# Altium project LbElectric.PrjPCB
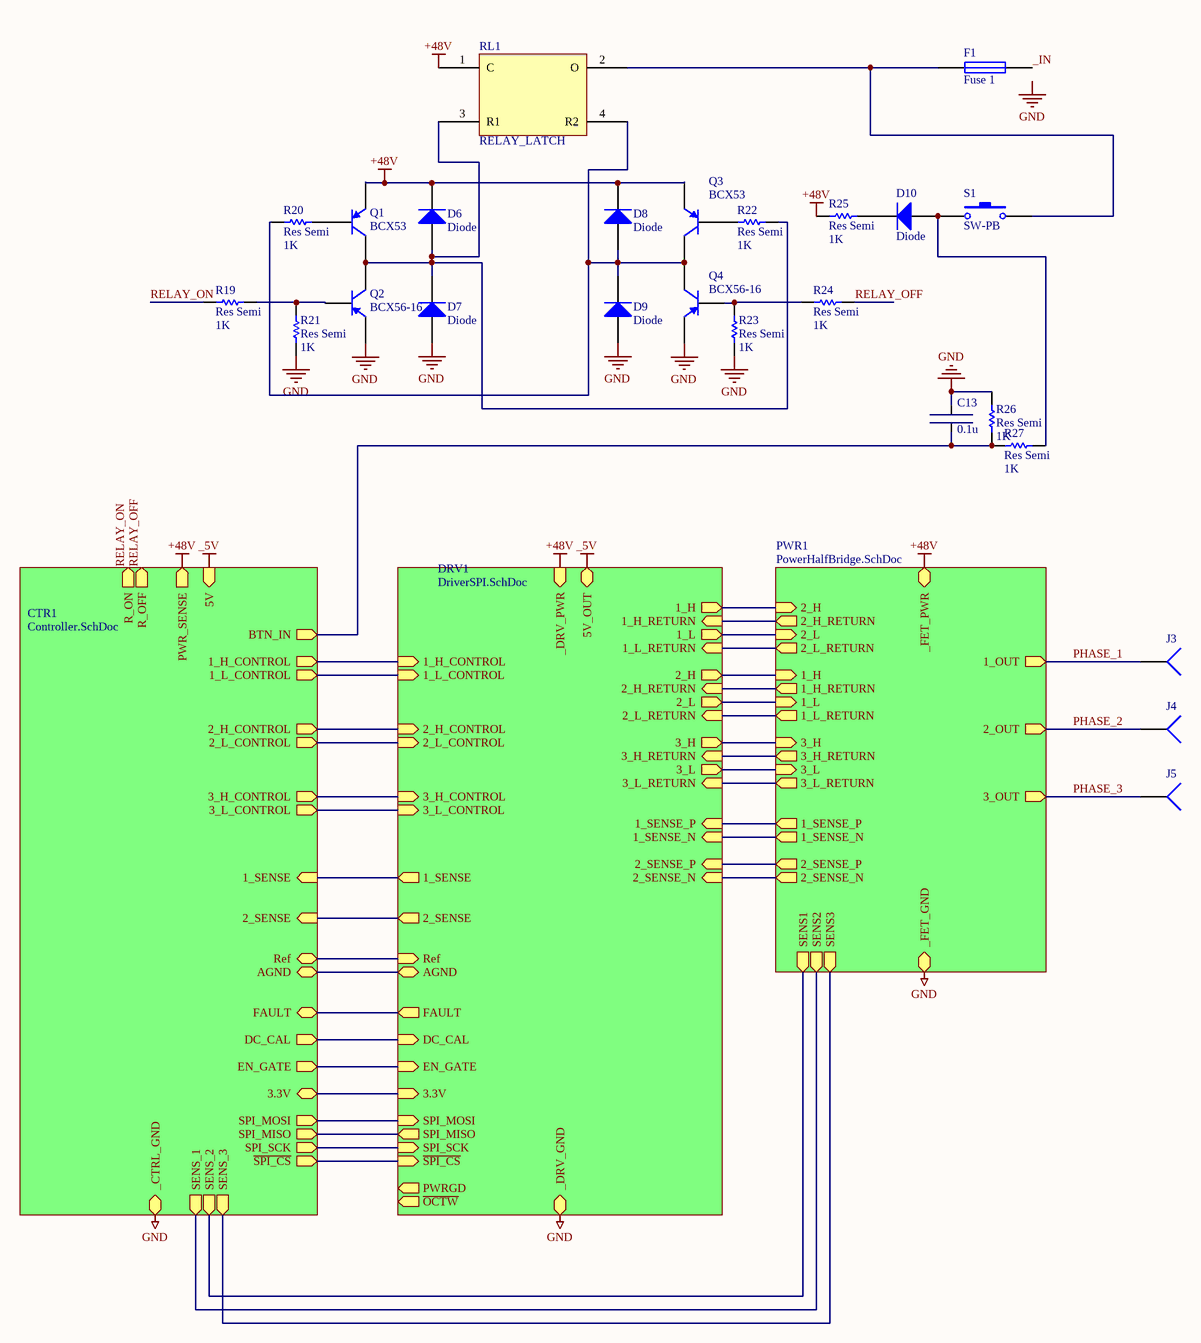
[diagram p0: Main.SchDoc]
4 sheets, 133 parts. Net scope: hierarchical (ports join the sheet entries above them; power ports are global).
Board file: LbElectric.PcbDoc
Sheets:
  Main.SchDoc
    PWR1 = PowerHalfBridge.SchDoc
    DRV1 = DriverSPI.SchDoc
    CTR1 = Controller.SchDoc

## Sheet Main.SchDoc
size A3; PageSetup: Record=PageOptions|CenterHorizontal=True|CenterVertical=True|PrintScale=0.67|XCorrection=1.00|YCorrection=1.00|PrintKind=2|BorderSize=5000000|LeftOffset=0|BottomOffset=0|Orientation=2|PaperLength=2970|PaperWidth=2100|Scale=100|PaperSource=7|PrintQuality=300|MediaType=1|DitherType=2|PrintScaleMode=1|PaperKind=A4|PaperIndex=9; Scale: 1:1; DocumentType: Схема электрическая принципиальная; FirstReferrence: АБВГ.123456.001

### Parts
(Parts that share a designator on the sheet are numbered #1, #2 ... from top to bottom, then left to right.)
C13#1  0.1u  [0805x]
D6  Diode  [DO214]
D7  Diode  [DO214]
D8  Diode  [DO214]
D9  Diode  [DO214]
D10  Diode  [SMB]
F1  Fuse 1  [FUSE_BIG]
J3  1  [BANANA-4MM]  (value not drawn)  (no BOM)
J4  2  [BANANA-4MM]  (value not drawn)  (no BOM)
J5  3  [BANANA-4MM]  (value not drawn)  (no BOM)
Q1  BCX53  [SOT89x]
Q2  BCX56-16  [SOT89x]
Q3  BCX53  [SOT89x]
Q4  BCX56-16  [SOT89x]
R19  Res Semi  value 1K  [0805x]
R20  Res Semi  value 1K  [0805x]
R21  Res Semi  value 1K  [0805x]
R22  Res Semi  value 1K  [0805x]
R23  Res Semi  value 1K  [0805x]
R24  Res Semi  value 1K  [0805x]
R25  Res Semi  value 1K  [RES_2W]
R26  Res Semi  value 1K  [0805x]
R27  Res Semi  value 1K  [0805x]
RL1  RELAY_LATCH  [LATCH_RELAY]
S1  SW-PB  [BTN_SMD_CORNER]

### Sub-sheets
CTR1 = Controller.SchDoc: FAULT, 1_L_CONTROL (out), 2_L_CONTROL (out), 3_L_CONTROL (out), DC_CAL (out), SPI_SCK (out), PWR_SENSE (out), 3_H_CONTROL (out), 2_H_CONTROL (out), 1_H_CONTROL (out), SPI_MOSI (out), ~{SPI_CS} (out), 1_SENSE (in), 2_SENSE (in), 5V (in), EN_GATE (out), _CTRL_GND, 3.3V, Ref, AGND, SPI_MISO (out), SENS_1 (out), SENS_2 (out), SENS_3 (out), BTN_IN (out), R_ON (out), R_OFF (out)
DRV1 = DriverSPI.SchDoc: 2_H (out), 1_H (out), 3_H (out), 2_L (out), 1_L (out), 3_L (out), 1_SENSE_P (in), 1_SENSE_N (in), 2_SENSE_P (in), 2_SENSE_N (in), 2_H_RETURN (in), 2_L_RETURN (in), 1_H_RETURN (in), 3_H_RETURN (in), 1_L_RETURN (in), 3_L_RETURN (in), 2_H_CONTROL (in), 2_L_CONTROL (in), 1_H_CONTROL (in), 1_L_CONTROL (in), 3_H_CONTROL (in), 3_L_CONTROL (in), 1_SENSE (out), 2_SENSE (out), _DRV_PWR (in), _DRV_GND (bidir), Ref (in), AGND (bidir), 5V_OUT, FAULT (out), EN_GATE (in), DC_CAL (in), 3.3V (in), SPI_MOSI (in), SPI_MISO (out), ~{SPI_CS} (in), SPI_SCK (in), PWRGD (out), ~{OCTW} (out)
PWR1 = PowerHalfBridge.SchDoc: 1_H (in), 2_H (in), 3_H (in), 1_L (in), 2_L (in), 3_L (in), 1_SENSE_P (out), 1_SENSE_N (out), 2_SENSE_N (out), 2_SENSE_P (out), _FET_PWR, _FET_GND, 1_OUT (out), 2_OUT (out), 3_OUT (out), 1_H_RETURN (out), 1_L_RETURN (out), 2_H_RETURN (out), 3_H_RETURN (out), 2_L_RETURN (out), 3_L_RETURN (out), SENS1 (out), SENS2 (out), SENS3 (out)

### Nets
+48V: D6.2(K) D8.2(K) Q1.1(E) Q3.1(E) R25.1 RL1.1(C) ; sheet PWR1/_FET_PWR, sheet DRV1/_DRV_PWR, sheet CTR1/PWR_SENSE
_5V: sheet DRV1/5V_OUT, sheet CTR1/5V
GND: C13#1.1 D7.1(A) D9.1(A) Q2.1(E) Q4.1(E) R21.1 R23.1 R26.1 ; sheet PWR1/_FET_GND, sheet PWR1/2_L_RETURN, sheet DRV1/1_L_RETURN, sheet DRV1/_DRV_GND, sheet CTR1/_CTRL_GND  [project net _CTRL_GND]
1_H_CONTROL: sheet DRV1/1_H_CONTROL, sheet CTR1/1_H_CONTROL
1_L_CONTROL: sheet DRV1/1_L_CONTROL, sheet CTR1/1_L_CONTROL
1_SENSE: sheet DRV1/1_SENSE, sheet CTR1/1_SENSE
2_H_CONTROL: sheet DRV1/2_H_CONTROL, sheet CTR1/2_H_CONTROL
2_L_CONTROL: sheet DRV1/2_L_CONTROL, sheet CTR1/2_L_CONTROL
2_SENSE: sheet DRV1/2_SENSE, sheet CTR1/2_SENSE
3_H_CONTROL: sheet DRV1/3_H_CONTROL, sheet CTR1/3_H_CONTROL
3_L_CONTROL: sheet DRV1/3_L_CONTROL, sheet CTR1/3_L_CONTROL
_3.3V: sheet DRV1/3.3V, sheet CTR1/3.3V
_AGND: sheet DRV1/AGND, sheet CTR1/AGND
_IN: F1.2
_REF: sheet DRV1/Ref, sheet CTR1/Ref
DC_CAL: sheet DRV1/DC_CAL, sheet CTR1/DC_CAL
EN_GATE: sheet DRV1/EN_GATE, sheet CTR1/EN_GATE
FAULT: sheet DRV1/FAULT, sheet CTR1/FAULT
PHASE_1: J3.1 ; sheet PWR1/1_OUT, sheet PWR1/1_H_RETURN, sheet DRV1/2_H_RETURN
PHASE_2: J4.1 ; sheet PWR1/2_OUT, sheet PWR1/2_H_RETURN, sheet DRV1/1_H_RETURN
PHASE_3: J5.1 ; sheet PWR1/3_OUT, sheet PWR1/3_H_RETURN, sheet DRV1/3_H_RETURN
RELAY_OFF: R24.1 ; sheet CTR1/R_OFF
RELAY_ON: R19.1 ; sheet CTR1/R_ON
~{SPI_CS}: sheet DRV1/~{SPI_CS}, sheet CTR1/~{SPI_CS}
SPI_MISO: sheet DRV1/SPI_MISO, sheet CTR1/SPI_MISO
SPI_MOSI: sheet DRV1/SPI_MOSI, sheet CTR1/SPI_MOSI
SPI_SCK: sheet DRV1/SPI_SCK, sheet CTR1/SPI_SCK
UH_P: sheet PWR1/1_H, sheet DRV1/2_H
UL_N: sheet PWR1/1_L_RETURN, sheet DRV1/2_L_RETURN
UL_P: sheet PWR1/1_L, sheet DRV1/2_L
VH_P: sheet PWR1/2_H, sheet DRV1/1_H
VL_P: sheet PWR1/2_L, sheet DRV1/1_L
WH_P: sheet PWR1/3_H, sheet DRV1/3_H
WL_N: sheet PWR1/3_L_RETURN, sheet DRV1/3_L_RETURN
WL_P: sheet PWR1/3_L, sheet DRV1/3_L
NetC13#1_2: C13#1.2 R26.2 R27.1 ; sheet CTR1/BTN_IN
NetD6_1: D6.1(A) D7.2(K) Q1.2(C) Q2.2(C) R22.2 RL1.3(R1)
NetD8_1: D8.1(A) D9.2(K) Q3.2(C) Q4.2(C) R20.1 RL1.4(R2)
NetD10_1: D10.1(A) R27.2 S1.1
NetD10_2: D10.2(K) R25.2
NetF1_1: F1.1 RL1.2(O) S1.2
NetIC1_14: sheet PWR1/SENS2, sheet CTR1/SENS_1
NetIC1_15: sheet PWR1/SENS1, sheet CTR1/SENS_2
NetIC1_16: sheet PWR1/SENS3, sheet CTR1/SENS_3
NetNT2_1: sheet PWR1/1_SENSE_P, sheet DRV1/1_SENSE_P
NetNT3_1: sheet PWR1/1_SENSE_N, sheet DRV1/1_SENSE_N
NetNT4_1: sheet PWR1/2_SENSE_P, sheet DRV1/2_SENSE_P
NetNT5_1: sheet PWR1/2_SENSE_N, sheet DRV1/2_SENSE_N
NetQ1_3: Q1.3(B) R20.2
NetQ2_3: Q2.3(B) R19.2 R21.2
NetQ3_3: Q3.3(B) R22.1
NetQ4_3: Q4.3(B) R23.2 R24.2

### Notes on the sheet
- Labels drawn without touching a wire or pin: GND
- Title
- Size:
- Date:
- A3
- Number:
- Time:
- Revision:
- Sheet
- of
- File:

### Library data of the parts
C13#1 = Ceramic Chip Capacitor: Value: CAP CER 0.1UF 50V X7R 0603; Order Number: 06035C104KAT2A; Distributor: AVX Corporation; Package: CAPC1608X08N(0603)
D6-D10 = Diode: Default Diode; Published: 8-Jun-2000; LatestRevisionDate: 17-Jul-2002; LatestRevisionNote: Re-released for DXP Platform.; PackageVersion: Sep-1996; PackageReference: SMC; Publisher: Altium Limited; PackageDescription: DO-214-AB/SMC; 2 C-Bend Leads; Body 7.9 x 5.9 mm, inc. leads (LxW); Code_JEDEC: DO-214-AB
F1 = Fuse 1: Fuse; Published: 8-Jun-2000; LatestRevisionDate: 17-Jul-2002; LatestRevisionNote: Re-released for DXP Platform.; PackageReference: PIN-W2/E2.8; Publisher: Altium Limited; PackageDescription: Thru-Hole; 2 Leads
J3-J5 = Socket: LatestRevisionDate: 17-Jul-2002; LatestRevisionNote: Re-released for DXP Platform.; Publisher: Altium Limited
Q1 Q3 = BCX53: PNP Medium Power Transistor; Published: 17-Sep-2003; LatestRevisionDate: 06-Jun-2005; LatestRevisionNote: PCB pad sequence reversed.; DatasheetVersion: 10-Oct-2001; PackageVersion: Apr-1999; PackageReference: SOT89; Publisher: Altium Limited; PackageDescription: SOT-89; Body 4.6 x 4.25 mm, inc. leads (LxW max); Reverse Pinning; Code_JEITA: SC-62; Code_JEDEC: TO-243-AA; Code_IPC: SOT 89; ComponentLink1Description: Manufacturer Link; ComponentLink1URL: http://www.semiconductors.philips.com/; ComponentLink2Description: Datasheet; ComponentLink2URL: http://www.semiconductors.philips.com/acrobat/datasheets/BCX51_52_53_4.pdf
Q2 Q4 = BCX53-16: PNP Medium Power Transistor; Published: 17-Sep-2003; LatestRevisionDate: 06-Jun-2005; LatestRevisionNote: PCB pad sequence reversed.; DatasheetVersion: 10-Oct-2001; PackageVersion: Apr-1999; PackageReference: SOT89; Publisher: Altium Limited; PackageDescription: SOT-89; Body 4.6 x 4.25 mm, inc. leads (LxW max); Reverse Pinning; Code_JEITA: SC-62; Code_JEDEC: TO-243-AA; Code_IPC: SOT 89; ComponentLink1Description: Manufacturer Link; ComponentLink1URL: http://www.semiconductors.philips.com/; ComponentLink2Description: Datasheet; ComponentLink2URL: http://www.semiconductors.philips.com/acrobat/datasheets/BCX51_52_53_4.pdf
R19-R27 = Res Semi: Semiconductor Resistor; Published: 8-Jun-2000; LatestRevisionDate: 17-Jul-2002; LatestRevisionNote: Re-released for DXP Platform.; PackageReference: AXIAL-0.5; Publisher: Altium Limited; PackageDescription: Axial Device, Thru-Hole; 2 Leads; 0.5 in Pin Spacing
S1 = SW-PB: Switch; Published: 24-Mar-1999; LatestRevisionDate: 17-Jul-2002; LatestRevisionNote: Re-released for DXP Platform.; PackageReference: SPST-2; Publisher: Altium Limited; PackageDescription: Switch; 2 Leads

## Sheet PowerHalfBridge.SchDoc
size A3
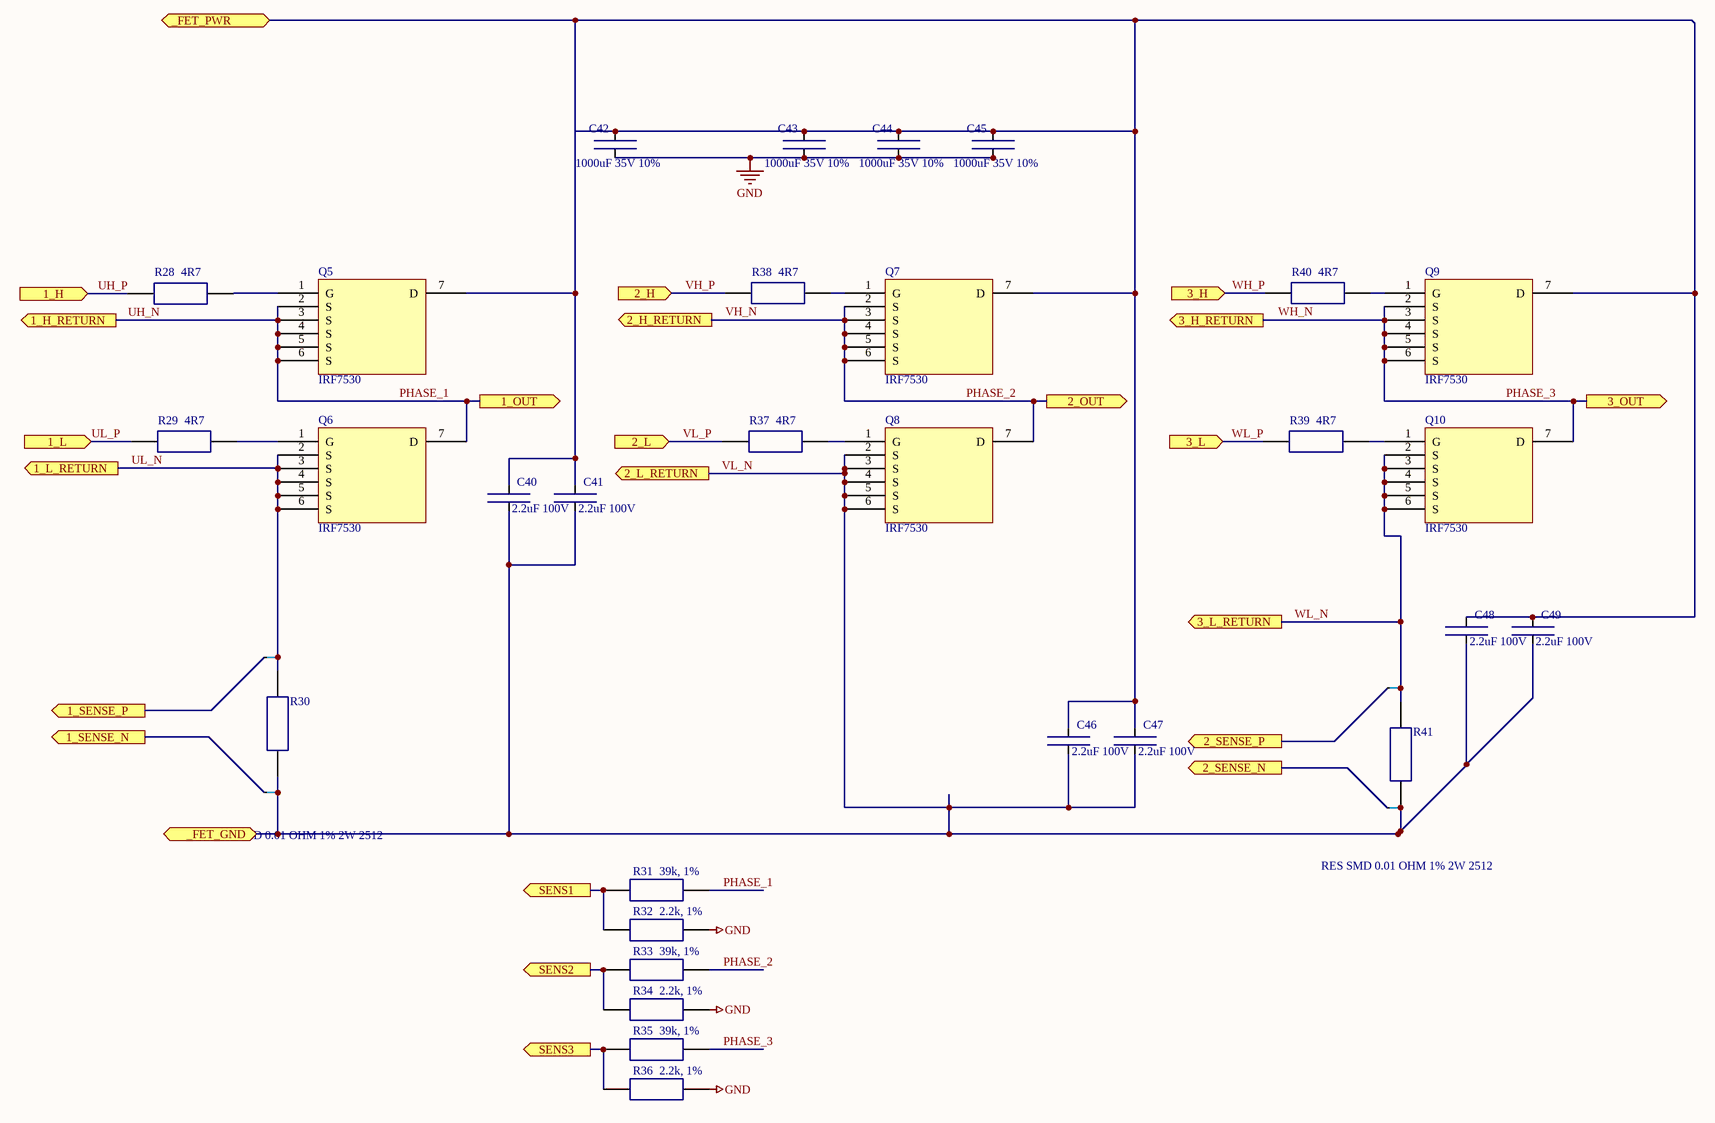
[diagram p1: PowerHalfBridge.SchDoc]

### Parts
C40  2.2uF 100V  [1210]
C41  2.2uF 100V  [1210]
C42  1000uF 35V 10%  [CAP_1000u_35V]
C43  1000uF 35V 10%  [CAP_1000u_35V]
C44  1000uF 35V 10%  [CAP_1000u_35V]
C45  1000uF 35V 10%  [CAP_1000u_35V]
C46  2.2uF 100V  [1210]
C47  2.2uF 100V  [1210]
C48  2.2uF 100V  [1210]
C49  2.2uF 100V  [1210]
NT2  NET_TIE  [NET_TIE_10mil]  (value not drawn)  (net tie, no BOM)
NT3  NET_TIE  [NET_TIE_10mil]  (value not drawn)  (net tie, no BOM)
NT4  NET_TIE  [NET_TIE_10mil]  (value not drawn)  (net tie, no BOM)
NT5  NET_TIE  [NET_TIE_10mil]  (value not drawn)  (net tie, no BOM)
Q5  IRF7530  [D2PAK-7]
Q6  IRF7530  [D2PAK-7]
Q7  IRF7530  [D2PAK-7]
Q8  IRF7530  [D2PAK-7]
Q9  IRF7530  [D2PAK-7]
Q10  IRF7530  [D2PAK-7]
R28  4R7  [0603x]
R29  4R7  [RESC1608X05N(0603)]
R30  RES SMD 0.01 OHM 1% 2W 2512  [1T-2512-5x]
R31  39k, 1%  [0805x]
R32  2.2k, 1%  [0805x]
R33  39k, 1%  [0805x]
R34  2.2k, 1%  [0805x]
R35  39k, 1%  [0805x]
R36  2.2k, 1%  [0805x]
R37  4R7  [RESC1608X05N(0603)]
R38  4R7  [RESC1608X05N(0603)]
R39  4R7  [RESC1608X05N(0603)]
R40  4R7  [RESC1608X05N(0603)]
R41  RES SMD 0.01 OHM 1% 2W 2512  [1T-2512-5x]

### Ports
1_H (in), 1_H_RETURN (out), 1_L (in), 1_L_RETURN (out), 1_OUT (out), 1_SENSE_N (out), 1_SENSE_P (out), 2_H (in), 2_H_RETURN (out), 2_L (in), 2_L_RETURN (out), 2_OUT (out), 2_SENSE_N (out), 2_SENSE_P (out), 3_H (in), 3_H_RETURN (out), 3_L (in), 3_L_RETURN (out), 3_OUT (out), _FET_GND, _FET_PWR, SENS1 (out), SENS2 (out), SENS3 (out)

### Nets
+48V: C40.1 C41.1 C42.1 C43.1 C44.1 C45.1 C46.1 C47.1 C48.1 C49.1 Q5.7(D) Q7.7(D) Q9.7(D) ; port _FET_PWR
GND: C40.2 C41.2 C42.2 C43.2 C44.2 C45.2 C46.2 C47.2 C48.2 C49.2 NT3.2 NT5.2 Q8.2(S) Q8.3(S) Q8.4(S) Q8.5(S) Q8.6(S) R30.2 R32.2 R34.2 R36.2 R41.2 ; port 2_L_RETURN, port _FET_GND  [also labelled VL_N]  [project net _CTRL_GND]
PHASE_1: Q5.2(S) Q5.3(S) Q5.4(S) Q5.5(S) Q5.6(S) Q6.7(D) R31.2 ; port 1_H_RETURN, port 1_OUT  [also labelled UH_N]
PHASE_2: Q7.2(S) Q7.3(S) Q7.4(S) Q7.5(S) Q7.6(S) Q8.7(D) R33.2 ; port 2_OUT, port 2_H_RETURN  [also labelled VH_N]
PHASE_3: Q9.2(S) Q9.3(S) Q9.4(S) Q9.5(S) Q9.6(S) Q10.7(D) R35.2 ; port 3_OUT, port 3_H_RETURN  [also labelled WH_N]
UH_P: R28.1 ; port 1_H
UL_N: NT2.2 Q6.2(S) Q6.3(S) Q6.4(S) Q6.5(S) Q6.6(S) R30.1 ; port 1_L_RETURN
UL_P: R29.1 ; port 1_L
VH_P: R38.1 ; port 2_H
VL_P: R37.1 ; port 2_L
WH_P: R40.1 ; port 3_H
WL_N: NT4.2 Q10.2(S) Q10.3(S) Q10.4(S) Q10.5(S) Q10.6(S) R41.1 ; port 3_L_RETURN
WL_P: R39.1 ; port 3_L
NetIC1_14: R33.1 R34.1 ; port SENS2
NetIC1_15: R31.1 R32.1 ; port SENS1
NetIC1_16: R35.1 R36.1 ; port SENS3
NetNT2_1: NT2.1 ; port 1_SENSE_P
NetNT3_1: NT3.1 ; port 1_SENSE_N
NetNT4_1: NT4.1 ; port 2_SENSE_P
NetNT5_1: NT5.1 ; port 2_SENSE_N
NetQ5_1: Q5.1(G) R28.2
NetQ6_1: Q6.1(G) R29.2
NetQ7_1: Q7.1(G) R38.2
NetQ8_1: Q8.1(G) R37.2
NetQ9_1: Q9.1(G) R40.2
NetQ10_1: Q10.1(G) R39.2

### Notes on the sheet
- Title
- Size:
- Date:
- A3
- Number:
- Time:
- Revision:
- Sheet
- of
- File:

### Library data of the parts
C40 C41 C46-C49 = Ceramic Chip Capacitor: Value: CAP CER 2.2UF 100V X7R 1210; Order Number: C1210X225K1RACAUTO; Distributor: KEMET; Package: 1210
C42-C45 = Ceramic Chip Capacitor: Value: CAP CER 0.022UF 50V X7R 0402; Order Number: GRM155R71H223KA12D; Distributor: Murata Electronics; Package: 0402
NT2-NT5 = Net tie
R28 R29 R37-R40 = SMD: Value: RES SMD 4.7 OHM 5% 1/10W 0603; Order Number: ERJ-3GEYJ4R7V; Distributor: Panasonic
  R28 R29 R37 R39 R40: Package: RESC1608X05N(0603)
  R38: Package: 0603
R30 R41 = SMD: Order Number: WSL2512R0100FEA; Value: RES SMD 0.01 OHM 1% 2W 2512; Package: 2512; Distributor: Vishay Dale
R31 R33 R35 = SMD: Order Number: ERJ-3EKF3902V; Value: 39k, 1%; Package: RESC1608X05N(0603); Distributor: Panasonic
R32 R34 R36 = SMD: Order Number: ERJ-3EKF2201V; Value: 2.2k, 1%; Package: RESC1608X05N(0603); Distributor: Panasonic

## Sheet DriverSPI.SchDoc
size A4
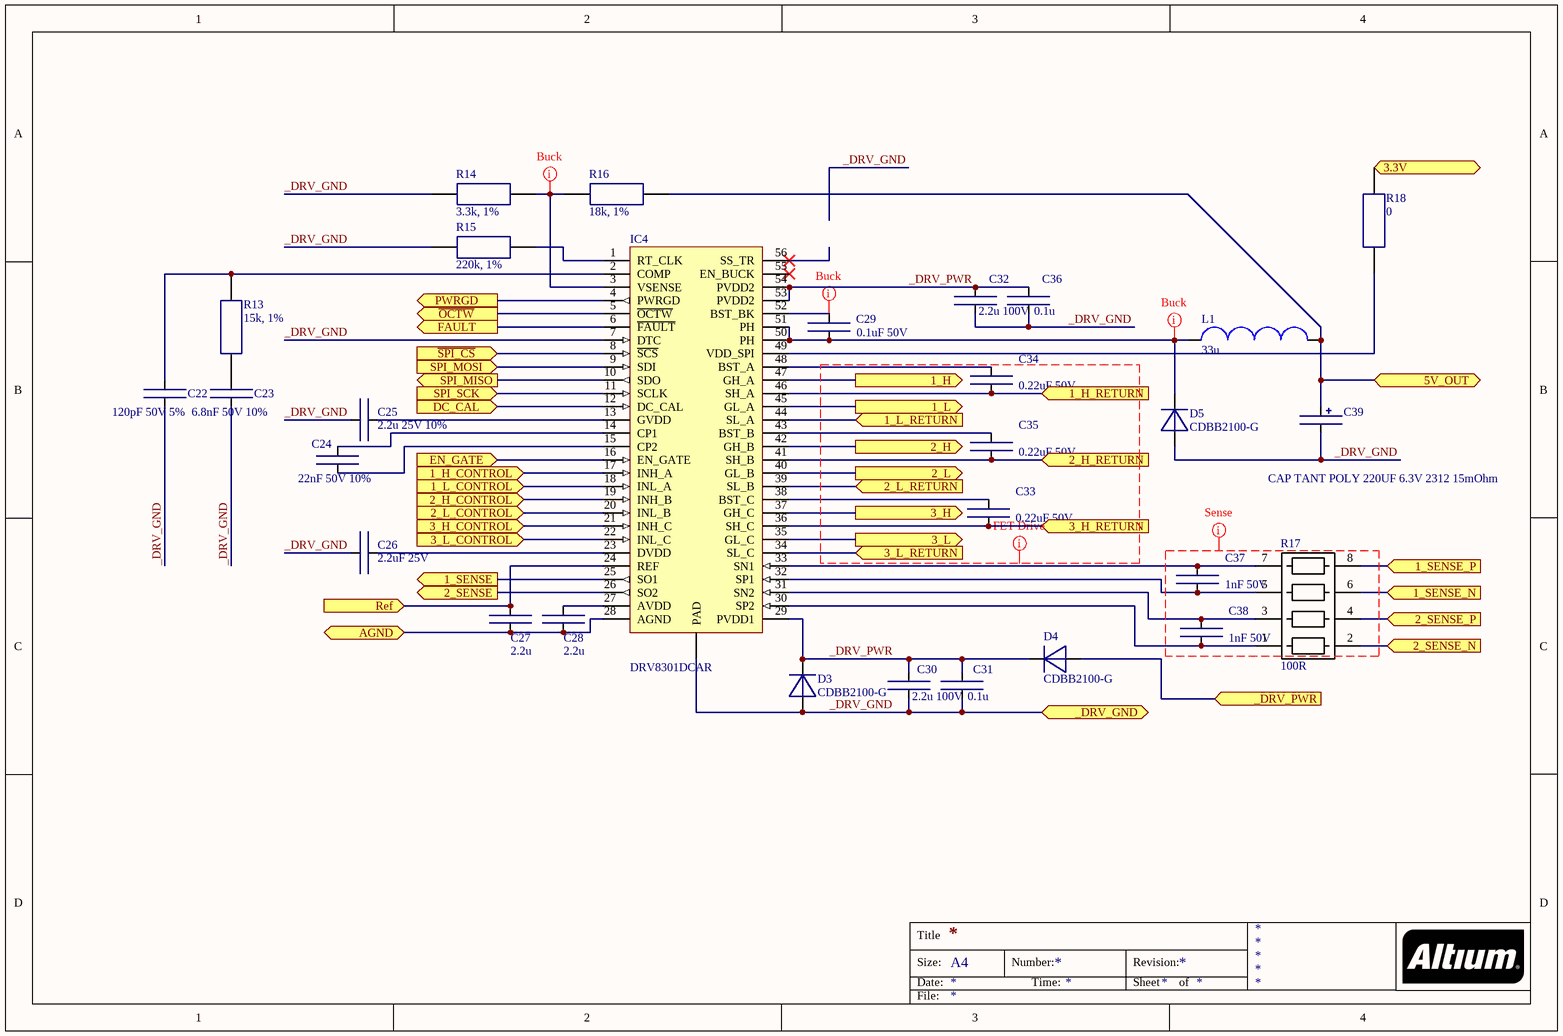
[diagram p2: DriverSPI.SchDoc]

### Parts
C22  120pF 50V 5%  [0402small]
C23  6.8nF 50V 10%  [0402small]
C24  22nF 50V 10%  [0402small]
C25  2.2u 25V 10%  [CAPC1608X08N(0603)]
C26  2.2uF 25V  [0603x]
C27  2.2u  [0603x]
C28  2.2u  [CAPC1608X08N(0603)]
C29  0.1uF 50V  [0402small]
C30  2.2u 100V  [EIA CC1210]
C31  0.1u  [C0805]
C32  2.2u 100V  [EIA CC1210]
C33  0.22uF 50V  [0402small]
C34  0.22uF 50V  [0402small]
C35  0.22uF 50V  [0402small]
C36  0.1u  [C0805]
C37  1nF 50V  [0402small]
C38  1nF 50V  [0402small]
C39  CAP TANT POLY 220UF 6.3V 2312 15mOhm  [C]
D3  CDBB2100-G  [SMB_real]
D4  CDBB2100-G  [SMB_real]
D5  CDBB2100-G  [SMB_real]
IC4  DRV8301DCAR  [HTSSOP56(L)]
L1  33u  [DR74]
R13  15k, 1%  [0402small]
R14  3.3k, 1%  [0402small]
R15  220k, 1%  [0402small]
R16  18k, 1%  [0402small]
R17  100R  [RES_ARRAY_4X]
R18  0  [1206x]

### Ports
1_H (out), 1_H_CONTROL (in), 1_H_RETURN (in), 1_L (out), 1_L_CONTROL (in), 1_L_RETURN (in), 1_SENSE (out), 1_SENSE_N (in), 1_SENSE_P (in), 2_H (out), 2_H_CONTROL (in), 2_H_RETURN (in), 2_L (out), 2_L_CONTROL (in), 2_L_RETURN (in), 2_SENSE (out), 2_SENSE_N (in), 2_SENSE_P (in), 3.3V (in), 3_H (out), 3_H_CONTROL (in), 3_H_RETURN (in), 3_L (out), 3_L_CONTROL (in), 3_L_RETURN (in), 5V_OUT, _DRV_GND (bidir), _DRV_PWR (in), AGND (bidir), DC_CAL (in), EN_GATE (in), FAULT (out), PWRGD (out), Ref (in), SPI_MISO (out), SPI_MOSI (in), SPI_SCK (in), ~{OCTW} (out), ~{SPI_CS} (in)

### Nets
+48V: D4.1 ; port _DRV_PWR
_5V: C39.1 L1.2 R16.1 ; port 5V_OUT
_DRV_GND: C22.1 C23.1 C25.1 C26.2 C30.2 C31.2 C32.2 C36.2 C39.2 D3.1 D5.1 IC4.7(DTC) IC4.44(SL_A) IC4.57(PAD) R14.2 R15.2 ; port 1_L_RETURN, port _DRV_GND  [project net _CTRL_GND]
1_H_CONTROL: IC4.17(INH_A) ; port 1_H_CONTROL
1_L_CONTROL: IC4.18(INL_A) ; port 1_L_CONTROL
1_SENSE: IC4.25(SO1) ; port 1_SENSE
2_H_CONTROL: IC4.19(INH_B) ; port 2_H_CONTROL
2_L_CONTROL: IC4.20(INL_B) ; port 2_L_CONTROL
2_SENSE: IC4.26(SO2) ; port 2_SENSE
3_H_CONTROL: IC4.21(INH_C) ; port 3_H_CONTROL
3_L_CONTROL: IC4.22(INL_C) ; port 3_L_CONTROL
_3.3V: R18.1 ; port 3.3V
_AGND: C27.2 C28.2 IC4.28(AGND) ; port AGND
_DRV_PWR: C30.1 C31.1 C32.1 C36.1 D3.2 D4.2 IC4.29(PVDD1) IC4.53(PVDD2) IC4.54(PVDD2)
_REF: C27.1 IC4.24(REF) ; port Ref
DC_CAL: IC4.12(DC_CAL) ; port DC_CAL
EN_GATE: IC4.16(EN_GATE) ; port EN_GATE
FAULT: IC4.6(~{FAULT}) ; port FAULT
PHASE_1: C35.1 IC4.41(SH_B) ; port 2_H_RETURN
PHASE_2: C34.1 IC4.46(SH_A) ; port 1_H_RETURN
PHASE_3: C33.1 IC4.36(SH_C) ; port 3_H_RETURN
~{SPI_CS}: IC4.8(~{SCS}) ; port ~{SPI_CS}
SPI_MISO: IC4.10(SDO) ; port SPI_MISO
SPI_MOSI: IC4.9(SDI) ; port SPI_MOSI
SPI_SCK: IC4.11(SCLK) ; port SPI_SCK
UH_P: IC4.42(GH_B) ; port 2_H
UL_N: IC4.39(SL_B) ; port 2_L_RETURN
UL_P: IC4.40(GL_B) ; port 2_L
VH_P: IC4.47(GH_A) ; port 1_H
VL_P: IC4.45(GL_A) ; port 1_L
WH_P: IC4.37(GH_C) ; port 3_H
WL_N: IC4.34(SL_C) ; port 3_L_RETURN
WL_P: IC4.35(GL_C) ; port 3_L
NetC22_2: C22.2 IC4.2(COMP) R13.2
NetC23_2: C23.2 R13.1
NetC24_1: C24.1 IC4.14(CP1)
NetC24_2: C24.2 IC4.15(CP2)
NetC25_2: C25.2 IC4.13(GVDD)
NetC26_1: C26.1 IC4.23(DVDD)
NetC28_1: C28.1 IC4.27(AVDD)
NetC29_1: C29.1 D5.2 IC4.50(PH) IC4.51(PH) L1.1
NetC29_2: C29.2 IC4.52(BST_BK)
NetC33_2: C33.2 IC4.38(BST_C)
NetC34_2: C34.2 IC4.48(BST_A)
NetC35_2: C35.2 IC4.43(BST_B)
NetC37_1: C37.1 IC4.32(SP1) R17.5
NetC37_2: C37.2 IC4.33(SN1) R17.7
NetC38_1: C38.1 IC4.30(SP2) R17.1
NetC38_2: C38.2 IC4.31(SN2) R17.3
NetIC4_1: IC4.1(RT_CLK) R15.1
NetIC4_3: IC4.3(VSENSE) R14.1 R16.2
NetIC4_4: IC4.4(PWRGD) ; port PWRGD
NetIC4_5: IC4.5(~{OCTW}) ; port ~{OCTW}
NetIC4_49: IC4.49(VDD_SPI) R18.2
NetNT2_1: R17.8 ; port 1_SENSE_P
NetNT3_1: R17.6 ; port 1_SENSE_N
NetNT4_1: R17.4 ; port 2_SENSE_P
NetNT5_1: R17.2 ; port 2_SENSE_N

Not connected (* = marked no-connect by the designer): IC4 55(EN_BUCK)* 56(SS_TR)*

### Layout directives
net class Sense: (no net found under the mark)
net class FET Drive: (no net found under the mark)
net class Buck: NetC29_1, NetC29_2, NetIC4_3

### Notes on the sheet
- Title
- Size:
- Date:
- A4
- Number:
- Time:
- Revision:
- Sheet
- of
- File:

### Library data of the parts
C22 = Ceramic Chip Capacitor: Value: CAP CER 120PF 50V NP0 0402; Order Number: C0402C121J5GACTU; Distributor: Panasonic; Package: 0402
C23 = Ceramic Chip Capacitor: Value: CAP CER 6800PF 50V X7R 0402; Order Number: GRM155R71H682KA88D; Distributor: Murata; Package: 0402
C24 = Ceramic Chip Capacitor: as C42 on sheet PowerHalfBridge; Distributor: Murata Electronics; Package: 0402
C25-C28 = Ceramic Chip Capacitor: Value: CAP CER 2.2UF 25V X5R 0603; Order Number: GRM188R61E225KA12D; Distributor: Murata Electronics; Package: 0603
C29 = Ceramic Chip Capacitor: Value: CAP CER 0.1UF 50V X5R 0402; Order Number: C1005X5R1H104K050BB; Distributor: TDK Corporation; Package: 0402
C30 C32 = Ceramic Chip Capacitor: as C40 on sheet PowerHalfBridge; Distributor: KEMET; Package: 1210
C31 C36 = Ceramic Chip Capacitor: Value: CAP CER 0.1UF 100V X7R 0805; Order Number: C0805C104K1RACTU; Distributor: KEMET; Package: 0805
C33-C35 = Ceramic Chip Capacitor: Value: CAP CER 0.22UF 50V X5R 0402; Order Number: UMK105BJ224KV-F; Distributor: Taiyo Yuden; Package: 0402
C37 C38 = Ceramic Chip Capacitor: Value: CAP CER 1000PF 50V C0G 0402; Order Number: CGA2B2C0G1H102J050BD; Distributor: TDK Corporation; Package: 0402
C39 = Tantalum Chip Capacitor: Order Number: T520C227M006ATE015; Value: CAP TANT POLY 220UF 6.3V 2312 15mOhm; Package: C; Distributor: KEMET
D3-D5 = ES1A...D: Value: SCHOTTKY 100V 2A DO214AA; Order Number: CDBB2100-G; Distributor: Comchip Technology; Package: SMB
IC4 = DRV8301: Value: DRV 8301 - IC MOTOR CONTROLLER SPI 56HTSSOP; Distributor: Texas Instruments; Order Number: DRV8301DCAR; Package: HTSSOP56
L1 = DR74: Value: FIXED IND 33UH 1.41A 143 MOHM; Order Number: DR74-330-R; Distributor: Eaton; Package: Nonstandard
R13 = SMD: Value: RES SMD 15K OHM 1% 1/10W 0402; Order Number: ERJ-2RKF1502X; Package: 0402; Distributor: Panasonic
R14 = SMD: Value: RES SMD 3.3K OHM 1% 1/10W 0402; Order Number: ERJ-2RKF3301X; Package: 0402; Distributor: Panasonic
R15 = SMD: Value: RES SMD 220K OHM 1% 1/10W 0402; Order Number: ERJ-2RKF2203X; Package: 0402; Distributor: Panasonic
R16 R18 = SMD: Value: RES SMD 18K OHM 1% 1/10W 0402; Order Number: ERJ-2RKF1802X; Package: 0402; Distributor: Panasonic
R17 = RES_Array_4x: 742C0431000FP; Order Number: EXB-38V101JV; Value: RES ARRAY 4 RES 100 OHM 1206; Distributor: Panasonic; Package: 1206 (3216 Metric)

## Sheet Controller.SchDoc
size A3
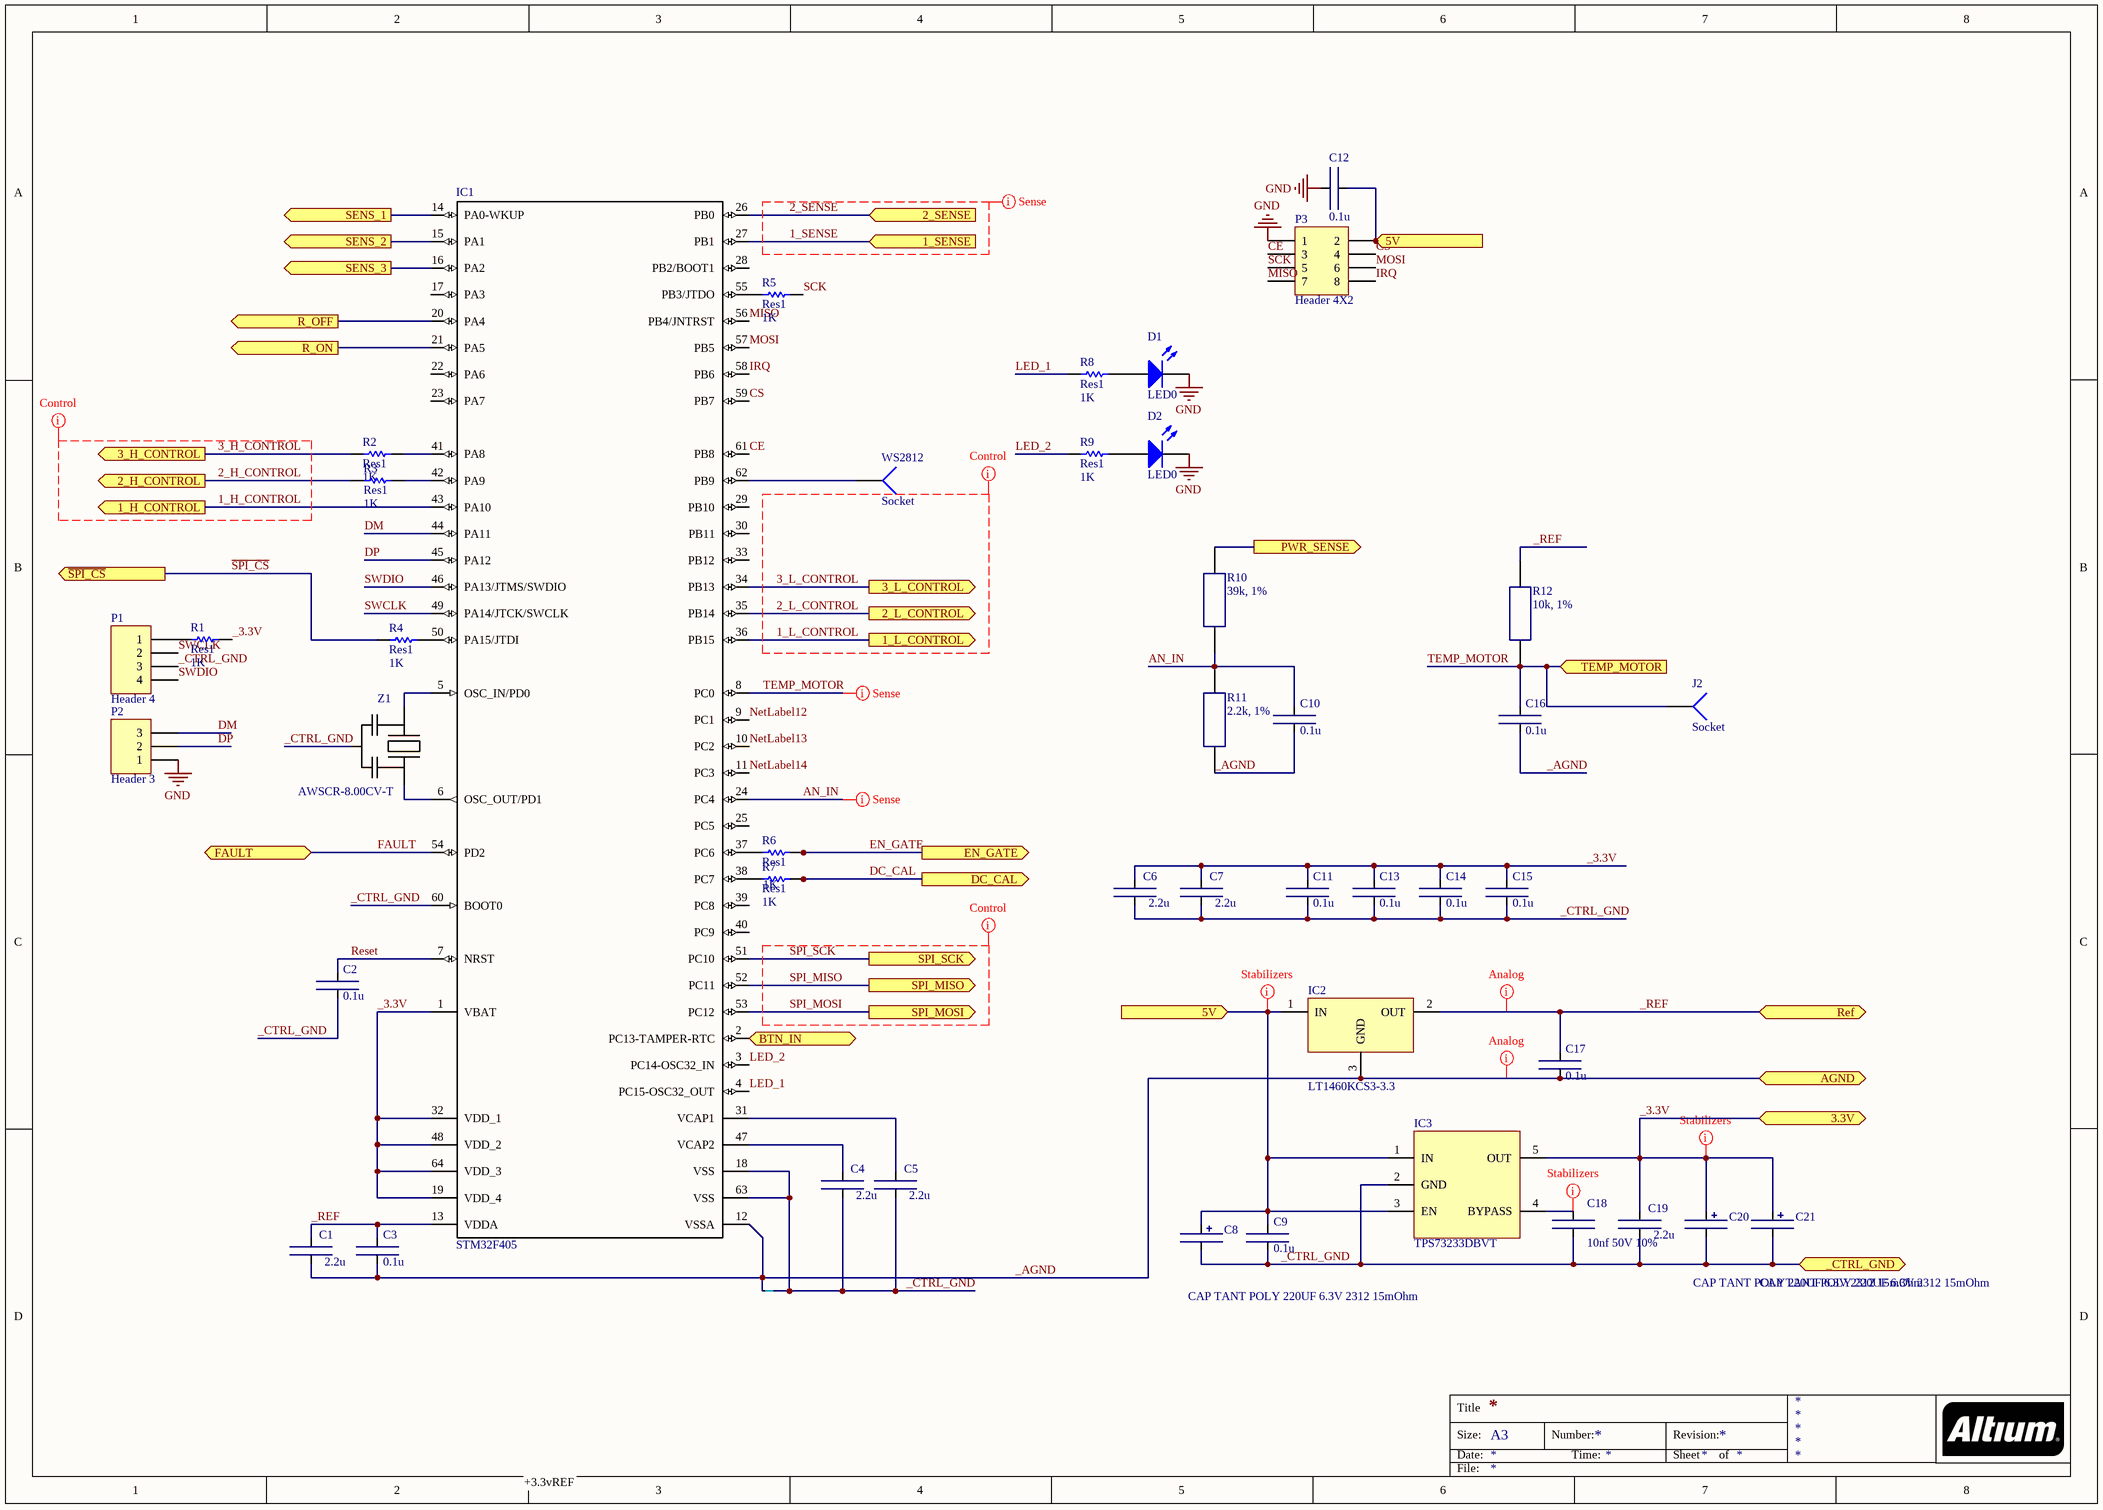
[diagram p3: Controller.SchDoc]

### Parts
(Parts that share a designator on the sheet are numbered #1, #2 ... from top to bottom, then left to right.)
C1  2.2u  [ERA-0603]
C2  0.1u  [CAPC1608X08N(0603)]
C3  0.1u  [ERA-0603]
C4  2.2u  [CAPC1608X08N(0603)]
C5  2.2u  [CAPC1608X08N(0603)]
C6  2.2u  [CAPC1608X08N(0603)]
C7  2.2u  [CAPC1608X08N(0603)]
C8  CAP TANT POLY 220UF 6.3V 2312 15mOhm  [CAP_POLY_330]
C9  0.1u  [ERA-0603]
C10  0.1u  [CAPC1608X08N(0603)]
C11  0.1u  [CAPC1608X08N(0603)]
C12  0.1u  [0805x]
C13#2  0.1u  [CAPC1608X08N(0603)]
C14  0.1u  [CAPC1608X08N(0603)]
C15  0.1u  [CAPC1608X08N(0603)]
C16  0.1u  [CAPC1608X08N(0603)]
C17  0.1u  [0603x]
C18  10nf 50V 10%  [0402small]
C19  2.2u  [CAPC1608X08N(0603)]
C20  CAP TANT POLY 220UF 6.3V 2312 15mOhm  [C]
C21  CAP TANT POLY 220UF 6.3V 2312 15mOhm  [CAP_POLY_330]
D1  LED0  [LED_3mm_SMD]
D2  LED0  [LED_3mm_SMD]
IC1  STM32F405  [LQFP64_L]
IC2  LT1460KCS3-3.3  [SOT23-3_L]
IC3  TPS73233DBVT  [SOT23-5_L]
J2  Socket  [PIN1]
NT1  NET_TIE  [NET_TIE_10mil]  (value not drawn)  (net tie, no BOM)
P1  Header 4  [MHDR1X4]
P2  Header 3  [HDR1X3]
P3  Header 4X2  [Nrf24l01]
R1  Res1  value 1K  [0603x]
R2  Res1  value 1K  [1206x]
R3  Res1  value 1K  [0603x]
R4  Res1  value 1K  [0603x]
R5  Res1  value 1K  [1206x]
R6  Res1  value 1K  [0805x]
R7  Res1  value 1K  [0603x]
R8  Res1  value 1K  [1206x]
R9  Res1  value 1K  [1206x]
R10  39k, 1%  [1206x]
R11  2.2k, 1%  [RESC1608X05N(0603)]
R12  10k, 1%  [RESC1608X05N(0603)]
WS2812  Socket  [PIN1]
Z1  AWSCR-8.00CV-T  [CRYSTAL_CERAMIC]

### Ports
1_H_CONTROL (out), 1_L_CONTROL (out), 1_SENSE (in), 2_H_CONTROL (out), 2_L_CONTROL (out), 2_SENSE (in), 3.3V, 3_H_CONTROL (out), 3_L_CONTROL (out), 5V (in), _CTRL_GND, AGND, BTN_IN, DC_CAL (out), EN_GATE (out), FAULT, PWR_SENSE (out), R_OFF (out), R_ON (out), Ref, SENS_1 (out), SENS_2 (out), SENS_3 (out), SPI_MISO (out), SPI_MOSI (out), SPI_SCK (out), TEMP_MOTOR (in), ~{SPI_CS} (out)

### Nets
+48V: R10.1 ; port PWR_SENSE
_5V: C8.1 C9.1 C12.2 IC2.1(IN) IC3.1(IN) IC3.3(EN) P3.2 ; port 5V
_CTRL_GND: C2.2 C4.2 C5.2 C6.2 C7.2 C8.2 C9.2 C11.2 C12.1 C13#2.2 C14.2 C15.2 C18.2 C19.2 C20.2 C21.2 D1.2(K) D2.2(K) IC1.18(VSS) IC1.60(BOOT0) IC1.63(VSS) IC3.2(GND) NT1.2 P1.3 P2.1 P3.1 Z1.2(GND) ; port _CTRL_GND  [also labelled GND]
1_H_CONTROL: IC1.43(PA10) ; port 1_H_CONTROL
1_L_CONTROL: IC1.36(PB15) ; port 1_L_CONTROL
1_SENSE: IC1.27(PB1) ; port 1_SENSE
2_H_CONTROL: R3.1 ; port 2_H_CONTROL
2_L_CONTROL: IC1.35(PB14) ; port 2_L_CONTROL
2_SENSE: IC1.26(PB0) ; port 2_SENSE
3_H_CONTROL: R2.1 ; port 3_H_CONTROL
3_L_CONTROL: IC1.34(PB13) ; port 3_L_CONTROL
_3.3V: C6.1 C7.1 C11.1 C13#2.1 C14.1 C15.1 C19.1 C20.1 C21.1 IC1.1(VBAT) IC1.19(VDD_4) IC1.32(VDD_1) IC1.48(VDD_2) IC1.64(VDD_3) IC3.5(OUT) R1.2 ; port 3.3V
_AGND: C1.2 C3.2 C10.2 C16.2 C17.2 IC1.12(VSSA) IC2.3(GND) NT1.1 R11.2 ; port AGND
_REF: C1.1 C3.1 C17.1 IC1.13(VDDA) IC2.2(OUT) R12.1 ; port Ref
AN_IN: C10.1 IC1.24(PC4) R10.2 R11.1
CE: IC1.61(PB8) P3.3
CS: IC1.59(PB7) P3.4
DC_CAL: R7.2 ; port DC_CAL
DM: IC1.44(PA11) P2.3
DP: IC1.45(PA12) P2.2
EN_GATE: R6.2 ; port EN_GATE
FAULT: IC1.54(PD2) ; port FAULT
IRQ: IC1.58(PB6) P3.8
LED_1: IC1.4(PC15-OSC32_OUT) R8.1
LED_2: IC1.3(PC14-OSC32_IN) R9.1
MISO: IC1.56(PB4/JNTRST) P3.7
MOSI: IC1.57(PB5) P3.6
NetLabel12: IC1.9(PC1)
NetLabel13: IC1.10(PC2)
NetLabel14: IC1.11(PC3)
RELAY_OFF: IC1.20(PA4) ; port R_OFF
RELAY_ON: IC1.21(PA5) ; port R_ON
Reset: C2.1 IC1.7(NRST)
~{SPI_CS}: R4.1 ; port ~{SPI_CS}
SCK: P3.5 R5.2
SPI_MISO: IC1.52(PC11) ; port SPI_MISO
SPI_MOSI: IC1.53(PC12) ; port SPI_MOSI
SPI_SCK: IC1.51(PC10) ; port SPI_SCK
SWCLK: IC1.49(PA14/JTCK/SWCLK) P1.2
SWDIO: IC1.46(PA13/JTMS/SWDIO) P1.4
TEMP_MOTOR: C16.1 IC1.8(PC0) J2.1 R12.2 ; port TEMP_MOTOR
NetC4_1: C4.1 IC1.47(VCAP2)
NetC5_1: C5.1 IC1.31(VCAP1)
NetC13#1_2: IC1.2(PC13-TAMPER-RTC) ; port BTN_IN
NetC18_1: C18.1 IC3.4(BYPASS)
NetD1_1: D1.1(A) R8.2
NetD2_1: D2.1(A) R9.2
NetIC1_5: IC1.5(OSC_IN/PD0) Z1.1(X1)
NetIC1_6: IC1.6(OSC_OUT/PD1) Z1.3(X2)
NetIC1_14: IC1.14(PA0-WKUP) ; port SENS_1
NetIC1_15: IC1.15(PA1) ; port SENS_2
NetIC1_16: IC1.16(PA2) ; port SENS_3
NetIC1_37: IC1.37(PC6) R6.1
NetIC1_38: IC1.38(PC7) R7.1
NetIC1_41: IC1.41(PA8) R2.2
NetIC1_42: IC1.42(PA9) R3.2
NetIC1_50: IC1.50(PA15/JTDI) R4.2
NetIC1_55: IC1.55(PB3/JTDO) R5.1
NetIC1_62: IC1.62(PB9) WS2812.1
NetP1_1: P1.1 R1.1

Not connected (* = marked no-connect by the designer): IC1 17(PA3) 22(PA6) 23(PA7) 25(PC5) 28(PB2/BOOT1) 29(PB10) 30(PB11) 33(PB12) 39(PC8) 40(PC9)

### Layout directives
net class Sense: 1_SENSE, 2_SENSE, AN_IN, TEMP_MOTOR
net class Stabilizers: _3.3V, _5V, _AGND, _REF, NetC18_1
net class Control: 1_H_CONTROL, 1_L_CONTROL, 2_H_CONTROL, 2_L_CONTROL, 3_H_CONTROL, 3_L_CONTROL, SPI_MISO, SPI_MOSI, SPI_SCK

### Notes on the sheet
- +3.3vREF
- Title
- Size:
- Date:
- A3
- Number:
- Time:
- Revision:
- Sheet
- of
- File:

### Library data of the parts
C1 C4-C7 C19 = Ceramic Chip Capacitor: as C25 on sheet DriverSPI; Distributor: Murata Electronics; Package: CAPC1608X08N(0603)
C2 C3 C9-C12 C13#2 C14-C17 = Ceramic Chip Capacitor: as C13#1 on sheet Main; Distributor: AVX Corporation
  C2 C3 C9 C10 C16 C17: Package: 0603
  C11 C12 C13#2 C14 C15: Package: CAPC1608X08N(0603)
C8 C20 C21 = Tantalum Chip Capacitor: Order Number: T520C227M006ATE015; Value: CAP TANT POLY 220UF 6.3V 2312 15mOhm; Package: C; Distributor: KEMET
C18 = Ceramic Chip Capacitor: Value: CAP CER 10000PF 50V X7R 0402; Order Number: CGA2B3X7R1H103K050BD; Distributor: TDK Corporation; Package: 0402
D1 D2 = LED0: Typical INFRARED GaAs LED; Published: 8-Jun-2000; LatestRevisionDate: 08-Jul-2005; LatestRevisionNote: Mech Layer 1 removed.; PackageReference: LED-0; Publisher: Altium Limited; PackageDescription: LED; 2 Leads
IC1 = STM32F405: STM32 ARM-based 32-bit MCU; Order Number: STM32F405RGT6; Value: STM32F405RGT6; Package: LQFP-64; Distributor: STMicroelectronics
IC2 = PreciseRef: Value: Voltage reference 3.3V 0.5% 50ppm/C; Order Number: LT1460KCS3-3.3#TRMPBF; Distrubutor: Linear Technology; Package: SOT23
IC3 = TPS7xx33: Value: LDO 3.3V 250mA; Order Number: TPS73233DBVT; Distributor: Texas Instruments; Package: SOT23-5
NT1 = Net tie
P1 = Header 4: Header, 4-Pin; LatestRevisionDate: 17-Jul-2002; LatestRevisionNote: Re-released for DXP Platform.; Publisher: Altium Limited
P2 = Header 3: Header, 3-Pin; LatestRevisionDate: 17-Jul-2002; LatestRevisionNote: Re-released for DXP Platform.; Publisher: Altium Limited
P3 = Header 4X2: Header, 4-Pin, Dual row; LatestRevisionDate: 17-Jul-2002; LatestRevisionNote: Re-released for DXP Platform.; Publisher: Altium Limited
R1-R9 = Res1: Resistor; Published: 8-Jun-2000; LatestRevisionDate: 17-Jul-2002; LatestRevisionNote: Re-released for DXP Platform.; PackageReference: AXIAL-0.3; Publisher: Altium Limited; PackageDescription: Axial Device, Thru-Hole; 2 Leads; 0.3 in Pin Spacing
R10 = SMD: Value: RES SMD 39K OHM 1% 1/10W 0603; Order Number: ERJ-3EKF3902V; Package: RESC1608X05N(0603); Distributor: Panasonic
R11 = SMD: Value: RES SMD 2.2K OHM 1% 1/10W 0603; Order Number: ERJ-3EKF2201V; Package: RESC1608X05N(0603); Distributor: Panasonic
R12 = SMD: Value: RES SMD 10K OHM 1% 1/10W 0603; Order Number: ERJ-3EKF1002V; Package: RESC1608X05N(0603); Distributor: Panasonic
Z1 = Crystal_smd_with_caps: Value: CER RES 8.0000MHZ 22PF SMD; Order Number: AWSCR-8.00CV-T; Distributor: Abracon LLC; Package: 3-SMD, Non-Standard
J2 WS2812 = Socket: LatestRevisionDate: 17-Jul-2002; LatestRevisionNote: Re-released for DXP Platform.; Publisher: Altium Limited

## Nets that join several sheets
+48V: Main (6 pins), PowerHalfBridge (13 pins), DriverSPI (D4.1), Controller (R10.1)
_5V: DriverSPI (C39.1 L1.2 R16.1), Controller (7 pins)
_CTRL_GND: Main (8 pins), PowerHalfBridge (22 pins), DriverSPI (16 pins), Controller (27 pins)
1_H_CONTROL: DriverSPI (IC4.17), Controller (IC1.43)
1_L_CONTROL: DriverSPI (IC4.18), Controller (IC1.36)
1_SENSE: DriverSPI (IC4.25), Controller (IC1.27)
2_H_CONTROL: DriverSPI (IC4.19), Controller (R3.1)
2_L_CONTROL: DriverSPI (IC4.20), Controller (IC1.35)
2_SENSE: DriverSPI (IC4.26), Controller (IC1.26)
3_H_CONTROL: DriverSPI (IC4.21), Controller (R2.1)
3_L_CONTROL: DriverSPI (IC4.22), Controller (IC1.34)
_3.3V: DriverSPI (R18.1), Controller (16 pins)
_AGND: DriverSPI (C27.2 C28.2 IC4.28), Controller (9 pins)
_REF: DriverSPI (C27.1 IC4.24), Controller (6 pins)
DC_CAL: DriverSPI (IC4.12), Controller (R7.2)
EN_GATE: DriverSPI (IC4.16), Controller (R6.2)
FAULT: DriverSPI (IC4.6), Controller (IC1.54)
NetC13#1_2: Main (C13#1.2 R26.2 R27.1), Controller (IC1.2)
NetIC1_14: PowerHalfBridge (R33.1 R34.1), Controller (IC1.14)
NetIC1_15: PowerHalfBridge (R31.1 R32.1), Controller (IC1.15)
NetIC1_16: PowerHalfBridge (R35.1 R36.1), Controller (IC1.16)
NetNT2_1: PowerHalfBridge (NT2.1), DriverSPI (R17.8)
NetNT3_1: PowerHalfBridge (NT3.1), DriverSPI (R17.6)
NetNT4_1: PowerHalfBridge (NT4.1), DriverSPI (R17.4)
NetNT5_1: PowerHalfBridge (NT5.1), DriverSPI (R17.2)
PHASE_1: Main (J3.1), PowerHalfBridge (7 pins), DriverSPI (C35.1 IC4.41)
PHASE_2: Main (J4.1), PowerHalfBridge (7 pins), DriverSPI (C34.1 IC4.46)
PHASE_3: Main (J5.1), PowerHalfBridge (7 pins), DriverSPI (C33.1 IC4.36)
RELAY_OFF: Main (R24.1), Controller (IC1.20)
RELAY_ON: Main (R19.1), Controller (IC1.21)
~{SPI_CS}: DriverSPI (IC4.8), Controller (R4.1)
SPI_MISO: DriverSPI (IC4.10), Controller (IC1.52)
SPI_MOSI: DriverSPI (IC4.9), Controller (IC1.53)
SPI_SCK: DriverSPI (IC4.11), Controller (IC1.51)
UH_P: PowerHalfBridge (R28.1), DriverSPI (IC4.42)
UL_N: PowerHalfBridge (7 pins), DriverSPI (IC4.39)
UL_P: PowerHalfBridge (R29.1), DriverSPI (IC4.40)
VH_P: PowerHalfBridge (R38.1), DriverSPI (IC4.47)
VL_P: PowerHalfBridge (R37.1), DriverSPI (IC4.45)
WH_P: PowerHalfBridge (R40.1), DriverSPI (IC4.37)
WL_N: PowerHalfBridge (7 pins), DriverSPI (IC4.34)
WL_P: PowerHalfBridge (R39.1), DriverSPI (IC4.35)

## Assembly variants
PCB_50 ver4 HALF_BRIDGES: all parts fitted